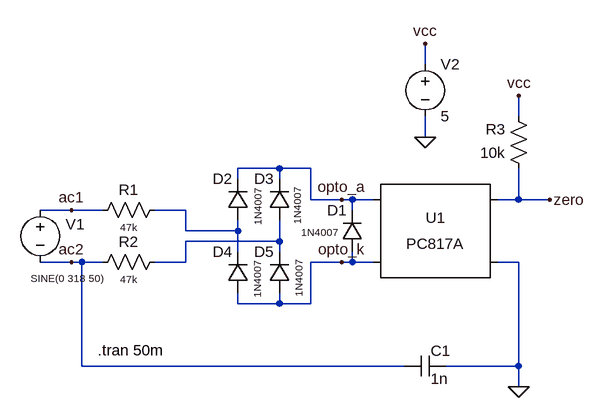
[diagram p0: schematic 01-one-opto.asc]
01-one-opto.asc, the LTspice schematic file:
Version 4
SHEET 1 1044 680
WIRE 784 -16 784 -48
WIRE 928 64 928 32
WIRE 784 96 784 64
WIRE 560 144 496 144
WIRE 608 144 560 144
WIRE 496 160 496 144
WIRE 560 160 560 144
WIRE 608 192 608 144
WIRE 656 192 608 192
WIRE 672 192 656 192
WIRE 704 192 672 192
WIRE 928 192 928 144
WIRE 928 192 896 192
WIRE 976 192 928 192
WIRE 240 208 192 208
WIRE 288 208 240 208
WIRE 416 208 368 208
WIRE 672 208 672 192
WIRE 416 240 416 208
WIRE 496 240 496 224
WIRE 496 240 416 240
WIRE 560 256 560 224
WIRE 560 256 416 256
WIRE 496 272 496 240
WIRE 560 272 560 256
WIRE 240 288 192 288
WIRE 256 288 240 288
WIRE 288 288 256 288
WIRE 416 288 416 256
WIRE 416 288 368 288
WIRE 656 288 608 288
WIRE 672 288 672 272
WIRE 672 288 656 288
WIRE 704 288 672 288
WIRE 928 288 896 288
WIRE 496 352 496 336
WIRE 560 352 560 336
WIRE 560 352 496 352
WIRE 608 352 608 288
WIRE 608 352 560 352
WIRE 256 448 256 288
WIRE 752 448 256 448
WIRE 928 448 928 288
WIRE 928 448 816 448
WIRE 928 480 928 448
FLAG 784 -48 vcc
FLAG 784 96 0
FLAG 928 480 0
FLAG 928 32 vcc
FLAG 976 192 zero
FLAG 240 208 ac1
FLAG 240 288 ac2
FLAG 656 192 opto_a
FLAG 656 288 opto_k
SYMBOL voltage 192 192 R0
WINDOW 0 39 38 Left 2
WINDOW 3 -15 121 Left 1
WINDOW 123 0 0 Left 0
WINDOW 39 0 0 Left 0
SYMATTR InstName V1
SYMATTR Value SINE(0 318 50)
SYMBOL Optos\\PC817A 800 240 R0
SYMATTR InstName U1
SYMBOL res 384 192 R90
WINDOW 0 0 56 VBottom 2
WINDOW 3 32 56 VTop 1
SYMATTR InstName R1
SYMATTR Value 47k
SYMBOL diode 688 272 R180
WINDOW 0 24 64 Left 2
WINDOW 3 38 30 Left 1
SYMATTR InstName D1
SYMATTR Value 1N4007
SYMBOL res 384 272 R90
WINDOW 0 0 56 VBottom 2
WINDOW 3 32 56 VTop 1
SYMATTR InstName R2
SYMATTR Value 47k
SYMBOL res 944 160 R180
WINDOW 0 36 76 Left 2
WINDOW 3 36 40 Left 2
SYMATTR InstName R3
SYMATTR Value 10k
SYMBOL voltage 784 -32 R0
WINDOW 123 0 0 Left 0
WINDOW 39 0 0 Left 0
SYMATTR InstName V2
SYMATTR Value 5
SYMBOL cap 816 432 R90
WINDOW 0 8 8 VBottom 2
WINDOW 3 20 10 VTop 2
SYMATTR InstName C1
SYMATTR Value 1n
SYMATTR SpiceLine V=2k
SYMBOL diode 512 224 R180
WINDOW 0 24 64 Left 2
WINDOW 3 -15 -8 VRight 1
SYMATTR InstName D2
SYMATTR Value 1N4007
SYMBOL diode 576 224 R180
WINDOW 0 24 64 Left 2
WINDOW 3 -12 50 VLeft 1
SYMATTR InstName D3
SYMATTR Value 1N4007
SYMBOL diode 512 336 R180
WINDOW 0 24 64 Left 2
WINDOW 3 -14 -7 VRight 1
SYMATTR InstName D4
SYMATTR Value 1N4007
SYMBOL diode 576 336 R180
WINDOW 0 24 64 Left 2
WINDOW 3 -14 -6 VRight 1
SYMATTR InstName D5
SYMATTR Value 1N4007
TEXT 280 424 Left 2 !.tran 50m

The netlist it stands for:
* 01-one-opto.asc
V1 ac1 ac2 SINE(0 318 50)
XU1 opto_a opto_k zero 0 PC817 Igain=1m
R1 N001 ac1 47k
D1 opto_k opto_a 1N4007
R2 N002 ac2 47k
R3 zero vcc 10k
V2 vcc 0 5
C1 0 ac2 1n V=2k
D2 N001 opto_a 1N4007
D3 N002 opto_a 1N4007
D4 opto_k N001 1N4007
D5 opto_k N002 1N4007
.model D D
.lib standard.dio
.tran 50m
.lib PC817.sub
.backanno
.end

* Results of the author's LTspice run, read from the files saved beside the schematic
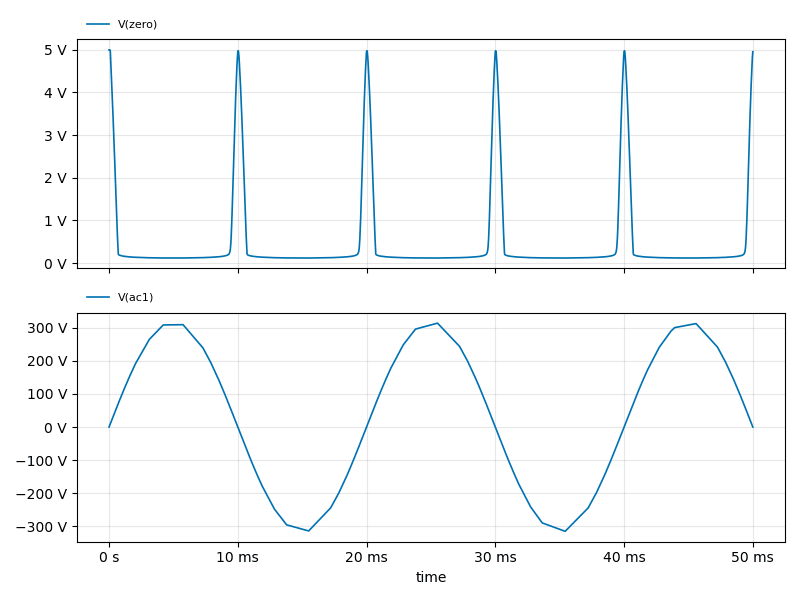
[diagram p1: Transient Analysis of 01-one-opto.asc, plotted from the saved traces]
* Transient Analysis, 1 run:
*   V(zero): min 117.5 mV, max 5 V, average 481.8 mV, rms 1.161 V, last 4.956 V
*   V(ac1): min -315 V, max 313.7 V, average 40.11 V, rms 222 V, last -1.006 mV